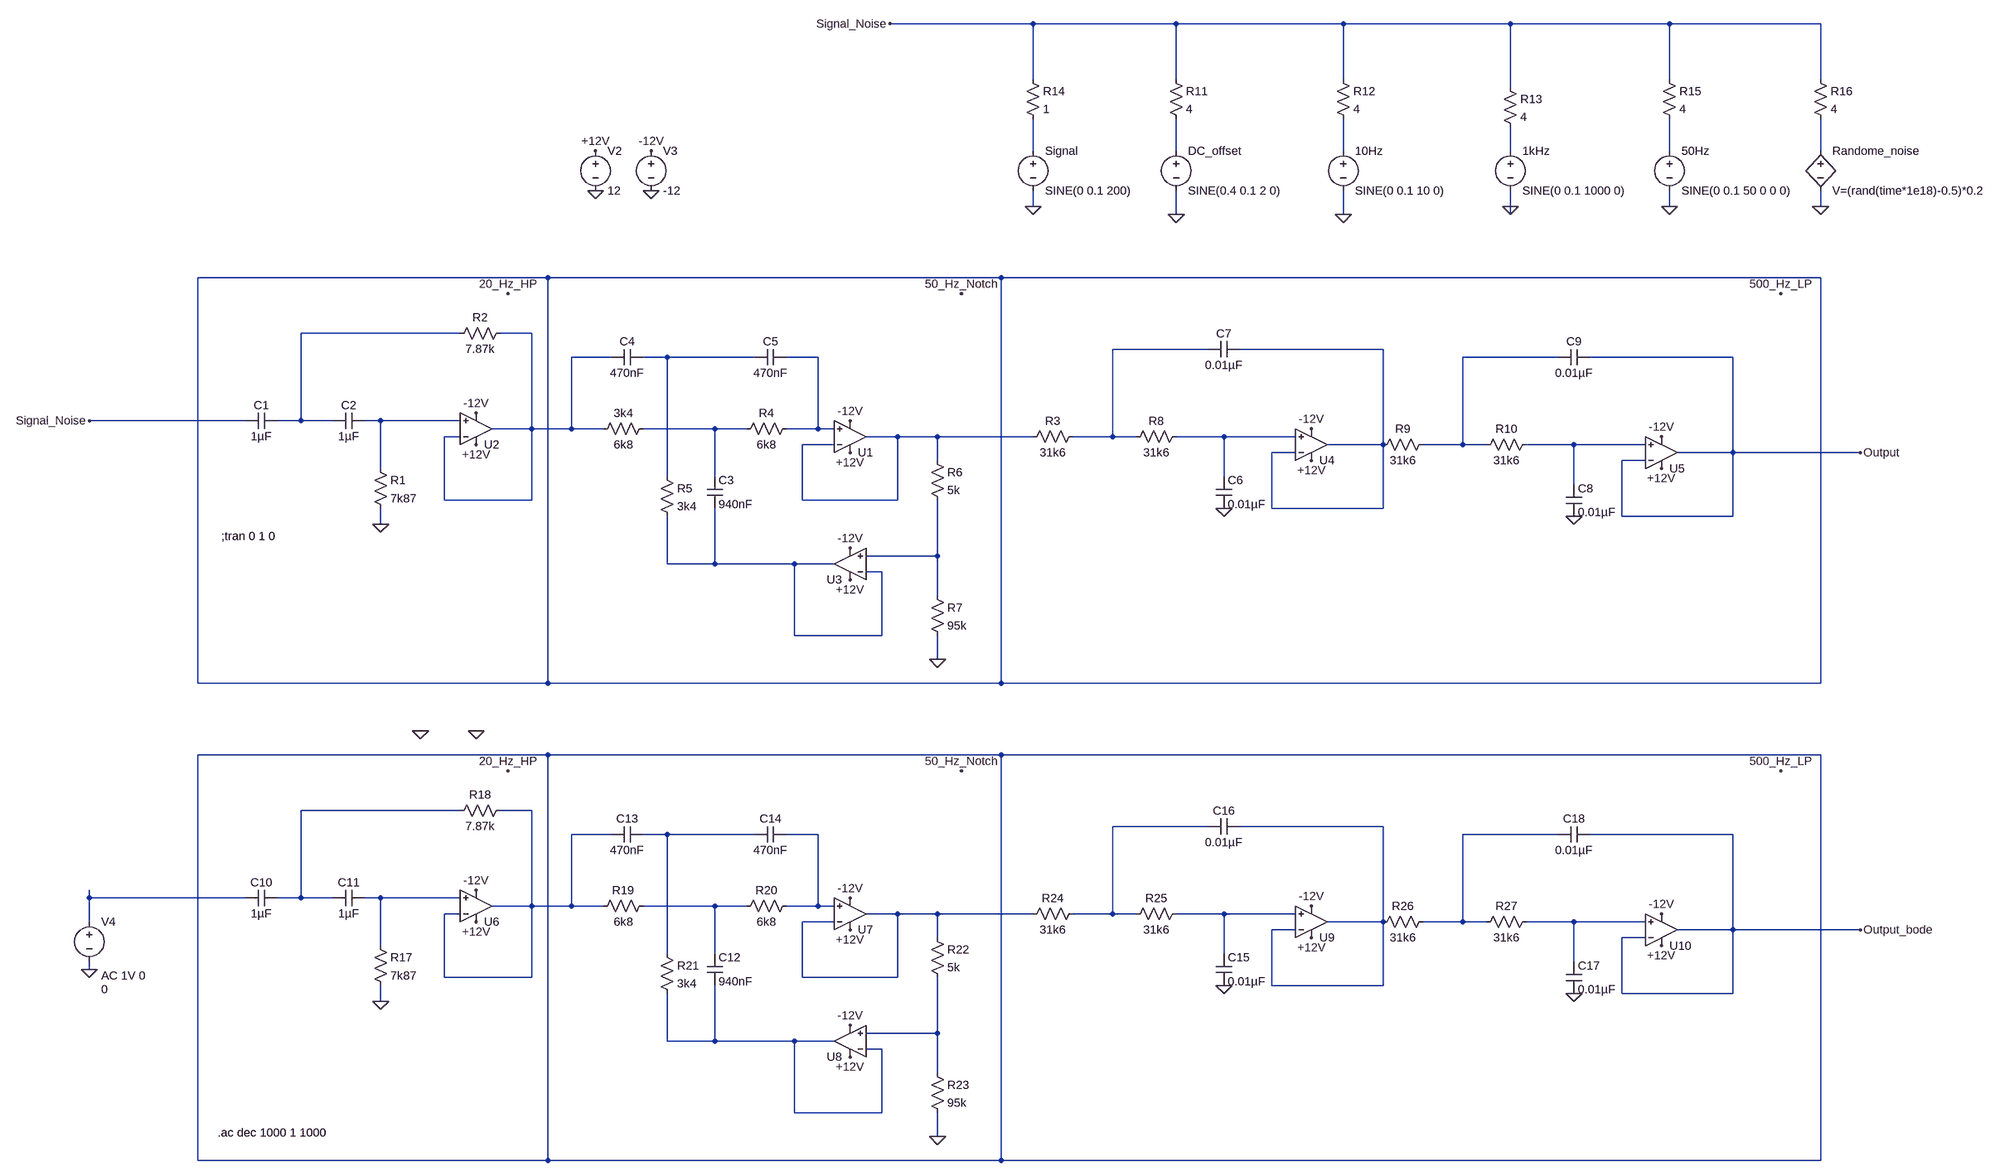
[diagram p0: schematic Analog_Filter_EMG.asc]
Analog_Filter_EMG.asc, the LTspice schematic file:
Version 4
SHEET 1 3124 1624
WIRE 1040 -912 752 -912
WIRE 1328 -912 1040 -912
WIRE 1664 -912 1328 -912
WIRE 2000 -912 1664 -912
WIRE 2320 -912 2000 -912
WIRE 2624 -912 2320 -912
WIRE 1040 -800 1040 -912
WIRE 1328 -800 1328 -912
WIRE 1664 -800 1664 -912
WIRE 2320 -800 2320 -912
WIRE 2624 -800 2624 -912
WIRE 2000 -784 2000 -912
WIRE 1040 -656 1040 -720
WIRE 1328 -656 1328 -720
WIRE 1664 -656 1664 -720
WIRE 2000 -656 2000 -704
WIRE 2320 -656 2320 -720
WIRE 2624 -656 2624 -720
WIRE 1040 -544 1040 -576
WIRE 2000 -544 2000 -576
WIRE 2320 -544 2320 -576
WIRE 2624 -544 2624 -576
WIRE 1328 -528 1328 -576
WIRE 1664 -528 1664 -576
WIRE 2000 -528 2000 -544
WIRE 64 -176 -640 -176
WIRE 976 -176 64 -176
WIRE 2624 -176 976 -176
WIRE -112 -64 -432 -64
WIRE 32 -64 -32 -64
WIRE 1392 -32 1200 -32
WIRE 1744 -32 1456 -32
WIRE 192 -16 112 -16
WIRE 304 -16 256 -16
WIRE 480 -16 304 -16
WIRE 608 -16 544 -16
WIRE 2096 -16 1904 -16
WIRE 2448 -16 2160 -16
WIRE -544 112 -928 112
WIRE -432 112 -432 -64
WIRE -432 112 -480 112
WIRE -368 112 -432 112
WIRE -272 112 -304 112
WIRE -112 112 -272 112
WIRE 32 128 32 -64
WIRE 32 128 -48 128
WIRE 112 128 112 -16
WIRE 112 128 32 128
WIRE 176 128 112 128
WIRE 400 128 256 128
WIRE 464 128 400 128
WIRE 608 128 608 -16
WIRE 608 128 544 128
WIRE 640 128 608 128
WIRE -112 144 -144 144
WIRE 768 144 704 144
WIRE 848 144 768 144
WIRE 1040 144 848 144
WIRE 1200 144 1200 -32
WIRE 1200 144 1120 144
WIRE 1248 144 1200 144
WIRE 1424 144 1328 144
WIRE 1568 144 1424 144
WIRE 640 160 576 160
WIRE 1744 160 1744 -32
WIRE 1744 160 1632 160
WIRE 1904 160 1904 -16
WIRE 1904 160 1824 160
WIRE 1952 160 1904 160
WIRE 2128 160 2032 160
WIRE 2272 160 2128 160
WIRE 1568 176 1520 176
WIRE 2448 176 2448 -16
WIRE 2448 176 2336 176
WIRE 2704 176 2448 176
WIRE 848 192 848 144
WIRE 2272 192 2224 192
WIRE -272 208 -272 112
WIRE 304 224 304 -16
WIRE 400 224 400 128
WIRE 1424 224 1424 144
WIRE 2128 240 2128 160
WIRE -144 272 -144 144
WIRE 32 272 32 128
WIRE 32 272 -144 272
WIRE 576 272 576 160
WIRE 768 272 768 144
WIRE 768 272 576 272
WIRE 1520 288 1520 176
WIRE 1744 288 1744 160
WIRE 1744 288 1520 288
WIRE 2224 304 2224 192
WIRE 2448 304 2448 176
WIRE 2448 304 2224 304
WIRE -272 320 -272 288
WIRE 848 384 848 272
WIRE 848 384 704 384
WIRE 304 400 304 304
WIRE 400 400 400 288
WIRE 400 400 304 400
WIRE 560 400 400 400
WIRE 640 400 560 400
WIRE 736 416 704 416
WIRE 848 464 848 384
WIRE 560 544 560 400
WIRE 736 544 736 416
WIRE 736 544 560 544
WIRE 848 592 848 544
WIRE -640 640 -640 -176
WIRE 64 640 64 -176
WIRE 64 640 -640 640
WIRE 976 640 976 -176
WIRE 976 640 64 640
WIRE 2624 640 2624 -176
WIRE 2624 640 976 640
WIRE 64 784 -640 784
WIRE 976 784 64 784
WIRE 2624 784 976 784
WIRE -112 896 -432 896
WIRE 32 896 -32 896
WIRE 1392 928 1200 928
WIRE 1744 928 1456 928
WIRE 192 944 112 944
WIRE 304 944 256 944
WIRE 480 944 304 944
WIRE 608 944 544 944
WIRE 2096 944 1904 944
WIRE 2448 944 2160 944
WIRE -928 1072 -928 1056
WIRE -544 1072 -928 1072
WIRE -432 1072 -432 896
WIRE -432 1072 -480 1072
WIRE -368 1072 -432 1072
WIRE -272 1072 -304 1072
WIRE -112 1072 -272 1072
WIRE 32 1088 32 896
WIRE 32 1088 -48 1088
WIRE 112 1088 112 944
WIRE 112 1088 32 1088
WIRE 176 1088 112 1088
WIRE 400 1088 256 1088
WIRE 464 1088 400 1088
WIRE 608 1088 608 944
WIRE 608 1088 544 1088
WIRE 640 1088 608 1088
WIRE -112 1104 -144 1104
WIRE 768 1104 704 1104
WIRE 848 1104 768 1104
WIRE 1040 1104 848 1104
WIRE 1200 1104 1200 928
WIRE 1200 1104 1120 1104
WIRE 1248 1104 1200 1104
WIRE 1424 1104 1328 1104
WIRE 1568 1104 1424 1104
WIRE -928 1120 -928 1072
WIRE 640 1120 576 1120
WIRE 1744 1120 1744 928
WIRE 1744 1120 1632 1120
WIRE 1904 1120 1904 944
WIRE 1904 1120 1824 1120
WIRE 1952 1120 1904 1120
WIRE 2128 1120 2032 1120
WIRE 2272 1120 2128 1120
WIRE 1568 1136 1520 1136
WIRE 2448 1136 2448 944
WIRE 2448 1136 2336 1136
WIRE 2704 1136 2448 1136
WIRE 848 1152 848 1104
WIRE 2272 1152 2224 1152
WIRE -272 1168 -272 1072
WIRE 304 1184 304 944
WIRE 400 1184 400 1088
WIRE 1424 1184 1424 1104
WIRE 2128 1200 2128 1120
WIRE -928 1216 -928 1200
WIRE -144 1232 -144 1104
WIRE 32 1232 32 1088
WIRE 32 1232 -144 1232
WIRE 576 1232 576 1120
WIRE 768 1232 768 1104
WIRE 768 1232 576 1232
WIRE 1520 1248 1520 1136
WIRE 1744 1248 1744 1120
WIRE 1744 1248 1520 1248
WIRE 2224 1264 2224 1152
WIRE 2448 1264 2448 1136
WIRE 2448 1264 2224 1264
WIRE -272 1280 -272 1248
WIRE 848 1344 848 1232
WIRE 848 1344 704 1344
WIRE 304 1360 304 1264
WIRE 400 1360 400 1248
WIRE 400 1360 304 1360
WIRE 560 1360 400 1360
WIRE 640 1360 560 1360
WIRE 736 1376 704 1376
WIRE 848 1424 848 1344
WIRE 560 1504 560 1360
WIRE 736 1504 736 1376
WIRE 736 1504 560 1504
WIRE 848 1552 848 1504
WIRE -640 1600 -640 784
WIRE 64 1600 64 784
WIRE 64 1600 -640 1600
WIRE 976 1600 976 784
WIRE 976 1600 64 1600
WIRE 2624 1600 2624 784
WIRE 2624 1600 976 1600
FLAG -272 320 0
FLAG 272 -576 0
FLAG 160 -576 0
FLAG 160 -656 +12V
FLAG 272 -656 -12V
FLAG -80 96 -12V
FLAG -80 160 +12V
FLAG 848 592 0
FLAG 672 112 -12V
FLAG 672 368 -12V
FLAG 672 176 +12V
FLAG 672 432 +12V
FLAG 1424 288 0
FLAG 1600 128 -12V
FLAG 1600 192 +12V
FLAG 2128 304 0
FLAG 2304 144 -12V
FLAG 2304 208 +12V
FLAG 1328 -528 0
FLAG 1664 -528 0
FLAG 2000 -544 0
FLAG 1040 -544 0
FLAG 752 -912 Signal_Noise
FLAG -928 112 Signal_Noise
FLAG 2320 -544 0
FLAG 2624 -544 0
FLAG -16 -144 20_Hz_HP
FLAG 896 -144 50_Hz_Notch
FLAG 2544 -144 500_Hz_LP
FLAG 2704 176 Output
FLAG -272 1280 0
FLAG -80 736 0
FLAG -192 736 0
FLAG -80 1056 -12V
FLAG -80 1120 +12V
FLAG 848 1552 0
FLAG 672 1072 -12V
FLAG 672 1328 -12V
FLAG 672 1136 +12V
FLAG 672 1392 +12V
FLAG 1424 1248 0
FLAG 1600 1088 -12V
FLAG 1600 1152 +12V
FLAG 2128 1264 0
FLAG 2304 1104 -12V
FLAG 2304 1168 +12V
FLAG -16 816 20_Hz_HP
FLAG 896 816 50_Hz_Notch
FLAG 2544 816 500_Hz_LP
FLAG 2704 1136 Output_bode
FLAG -928 1216 0
SYMBOL cap -480 96 R90
WINDOW 0 0 32 VBottom 2
WINDOW 3 32 32 VTop 2
SYMATTR InstName C1
SYMATTR Value 1µF
SYMBOL cap -304 96 R90
WINDOW 0 0 32 VBottom 2
WINDOW 3 32 32 VTop 2
SYMATTR InstName C2
SYMATTR Value 1µF
SYMBOL res -288 192 R0
SYMATTR InstName R1
SYMATTR Value 7k87
SYMBOL res -16 -80 R90
WINDOW 0 0 56 VBottom 2
WINDOW 3 32 56 VTop 2
SYMATTR InstName R2
SYMATTR Value 7.87k
SYMBOL voltage 1664 -672 R0
WINDOW 123 0 0 Left 0
WINDOW 39 0 0 Left 0
SYMATTR InstName 10Hz
SYMATTR Value SINE(0 0.1 10 0)
SYMBOL Opamps\\UniversalOpamp2 -80 128 M180
SYMATTR InstName U2
SYMBOL voltage 160 -672 R0
WINDOW 123 0 0 Left 0
WINDOW 39 0 0 Left 0
SYMATTR InstName V2
SYMATTR Value 12
SYMBOL voltage 272 -672 R0
WINDOW 123 0 0 Left 0
WINDOW 39 0 0 Left 0
SYMATTR InstName V3
SYMATTR Value -12
SYMBOL res 272 112 R90
WINDOW 0 0 56 VBottom 2
WINDOW 3 32 56 VTop 2
SYMATTR InstName 3k4
SYMATTR Value 6k8
SYMBOL res 560 112 R90
WINDOW 0 0 56 VBottom 2
WINDOW 3 32 56 VTop 2
SYMATTR InstName R4
SYMATTR Value 6k8
SYMBOL cap 384 224 R0
SYMATTR InstName C3
SYMATTR Value 940nF
SYMBOL res 288 208 R0
SYMATTR InstName R5
SYMATTR Value 3k4
SYMBOL cap 256 -32 R90
WINDOW 0 0 32 VBottom 2
WINDOW 3 32 32 VTop 2
SYMATTR InstName C4
SYMATTR Value 470nF
SYMBOL cap 544 -32 R90
WINDOW 0 0 32 VBottom 2
WINDOW 3 32 32 VTop 2
SYMATTR InstName C5
SYMATTR Value 470nF
SYMBOL res 832 176 R0
SYMATTR InstName R6
SYMATTR Value 5k
SYMBOL res 832 448 R0
SYMATTR InstName R7
SYMATTR Value 95k
SYMBOL Opamps\\UniversalOpamp2 672 144 M180
SYMATTR InstName U1
SYMBOL Opamps\\UniversalOpamp2 672 400 R180
SYMATTR InstName U3
SYMBOL res 1136 128 R90
WINDOW 0 0 56 VBottom 2
WINDOW 3 32 56 VTop 2
SYMATTR InstName R3
SYMATTR Value 31k6
SYMBOL res 1344 128 R90
WINDOW 0 0 56 VBottom 2
WINDOW 3 32 56 VTop 2
SYMATTR InstName R8
SYMATTR Value 31k6
SYMBOL cap 1408 224 R0
SYMATTR InstName C6
SYMATTR Value 0.01µF
SYMBOL cap 1456 -48 R90
WINDOW 0 0 32 VBottom 2
WINDOW 3 32 32 VTop 2
SYMATTR InstName C7
SYMATTR Value 0.01µF
SYMBOL Opamps\\UniversalOpamp2 1600 160 M180
SYMATTR InstName U4
SYMBOL res 1840 144 R90
WINDOW 0 0 56 VBottom 2
WINDOW 3 32 56 VTop 2
SYMATTR InstName R9
SYMATTR Value 31k6
SYMBOL res 2048 144 R90
WINDOW 0 0 56 VBottom 2
WINDOW 3 32 56 VTop 2
SYMATTR InstName R10
SYMATTR Value 31k6
SYMBOL cap 2112 240 R0
SYMATTR InstName C8
SYMATTR Value 0.01µF
SYMBOL cap 2160 -32 R90
WINDOW 0 0 32 VBottom 2
WINDOW 3 32 32 VTop 2
SYMATTR InstName C9
SYMATTR Value 0.01µF
SYMBOL Opamps\\UniversalOpamp2 2304 176 M180
SYMATTR InstName U5
SYMBOL voltage 2000 -672 R0
WINDOW 123 0 0 Left 0
WINDOW 39 0 0 Left 0
SYMATTR InstName 1kHz
SYMATTR Value SINE(0 0.1 1000 0)
SYMBOL voltage 1328 -672 R0
WINDOW 123 0 0 Left 0
WINDOW 39 0 0 Left 0
SYMATTR InstName DC_offset
SYMATTR Value SINE(0.4 0.1 2 0)
SYMBOL res 1312 -816 R0
SYMATTR InstName R11
SYMATTR Value 4
SYMBOL res 1648 -816 R0
SYMATTR InstName R12
SYMATTR Value 4
SYMBOL res 1984 -800 R0
SYMATTR InstName R13
SYMATTR Value 4
SYMBOL voltage 1040 -672 R0
WINDOW 123 0 0 Left 0
WINDOW 39 0 0 Left 0
SYMATTR InstName Signal
SYMATTR Value SINE(0 0.1 200)
SYMBOL res 1024 -816 R0
SYMATTR InstName R14
SYMATTR Value 1
SYMBOL voltage 2320 -672 R0
WINDOW 123 0 0 Left 0
WINDOW 39 0 0 Left 0
SYMATTR InstName 50Hz
SYMATTR Value SINE(0 0.1 50 0 0 0)
SYMBOL res 2304 -816 R0
SYMATTR InstName R15
SYMATTR Value 4
SYMBOL bv 2624 -672 R0
SYMATTR InstName Randome_noise
SYMATTR Value V=(rand(time*1e18)-0.5)*0.2
SYMBOL res 2608 -816 R0
SYMATTR InstName R16
SYMATTR Value 4
SYMBOL cap -480 1056 R90
WINDOW 0 0 32 VBottom 2
WINDOW 3 32 32 VTop 2
SYMATTR InstName C10
SYMATTR Value 1µF
SYMBOL cap -304 1056 R90
WINDOW 0 0 32 VBottom 2
WINDOW 3 32 32 VTop 2
SYMATTR InstName C11
SYMATTR Value 1µF
SYMBOL res -288 1152 R0
SYMATTR InstName R17
SYMATTR Value 7k87
SYMBOL res -16 880 R90
WINDOW 0 0 56 VBottom 2
WINDOW 3 32 56 VTop 2
SYMATTR InstName R18
SYMATTR Value 7.87k
SYMBOL Opamps\\UniversalOpamp2 -80 1088 M180
SYMATTR InstName U6
SYMBOL res 272 1072 R90
WINDOW 0 0 56 VBottom 2
WINDOW 3 32 56 VTop 2
SYMATTR InstName R19
SYMATTR Value 6k8
SYMBOL res 560 1072 R90
WINDOW 0 0 56 VBottom 2
WINDOW 3 32 56 VTop 2
SYMATTR InstName R20
SYMATTR Value 6k8
SYMBOL cap 384 1184 R0
SYMATTR InstName C12
SYMATTR Value 940nF
SYMBOL res 288 1168 R0
SYMATTR InstName R21
SYMATTR Value 3k4
SYMBOL cap 256 928 R90
WINDOW 0 0 32 VBottom 2
WINDOW 3 32 32 VTop 2
SYMATTR InstName C13
SYMATTR Value 470nF
SYMBOL cap 544 928 R90
WINDOW 0 0 32 VBottom 2
WINDOW 3 32 32 VTop 2
SYMATTR InstName C14
SYMATTR Value 470nF
SYMBOL res 832 1136 R0
SYMATTR InstName R22
SYMATTR Value 5k
SYMBOL res 832 1408 R0
SYMATTR InstName R23
SYMATTR Value 95k
SYMBOL Opamps\\UniversalOpamp2 672 1104 M180
SYMATTR InstName U7
SYMBOL Opamps\\UniversalOpamp2 672 1360 R180
SYMATTR InstName U8
SYMBOL res 1136 1088 R90
WINDOW 0 0 56 VBottom 2
WINDOW 3 32 56 VTop 2
SYMATTR InstName R24
SYMATTR Value 31k6
SYMBOL res 1344 1088 R90
WINDOW 0 0 56 VBottom 2
WINDOW 3 32 56 VTop 2
SYMATTR InstName R25
SYMATTR Value 31k6
SYMBOL cap 1408 1184 R0
SYMATTR InstName C15
SYMATTR Value 0.01µF
SYMBOL cap 1456 912 R90
WINDOW 0 0 32 VBottom 2
WINDOW 3 32 32 VTop 2
SYMATTR InstName C16
SYMATTR Value 0.01µF
SYMBOL Opamps\\UniversalOpamp2 1600 1120 M180
SYMATTR InstName U9
SYMBOL res 1840 1104 R90
WINDOW 0 0 56 VBottom 2
WINDOW 3 32 56 VTop 2
SYMATTR InstName R26
SYMATTR Value 31k6
SYMBOL res 2048 1104 R90
WINDOW 0 0 56 VBottom 2
WINDOW 3 32 56 VTop 2
SYMATTR InstName R27
SYMATTR Value 31k6
SYMBOL cap 2112 1200 R0
SYMATTR InstName C17
SYMATTR Value 0.01µF
SYMBOL cap 2160 928 R90
WINDOW 0 0 32 VBottom 2
WINDOW 3 32 32 VTop 2
SYMATTR InstName C18
SYMATTR Value 0.01µF
SYMBOL Opamps\\UniversalOpamp2 2304 1136 M180
SYMATTR InstName U10
SYMBOL voltage -928 1104 R0
WINDOW 3 24 152 Left 2
WINDOW 123 24 124 Left 2
WINDOW 39 0 0 Left 0
SYMATTR Value 0
SYMATTR Value2 AC 1V 0
SYMATTR InstName V4
TEXT -592 344 Left 2 !;tran 0 1 0
TEXT -600 1544 Left 2 !.ac dec 1000 1 1000

The netlist it stands for:
* Analog_Filter_EMG.asc
C1 N008 Signal_Noise 1µF
C2 N015 N008 1µF
R1 N015 0 7k87
R2 N009 N008 7.87k
V§10Hz N003 0 SINE(0 0.1 10 0)
XU2 N015 N009 +12V -12V N009 level.2 Avol=1Meg GBW=10Meg Slew=10Meg ilimit=25m rail=0 Vos=0 phimargin=45 en=0 enk=0 in=0 ink=0 Rin=500Meg  ; pins IN+ IN- V+ V- OUT
V2 +12V 0 12
V3 -12V 0 -12
R§3k4 N016 N009 6k8
R4 N013 N016 6k8
C3 N016 N021 940nF
R5 N012 N021 3k4
C4 N012 N009 470nF
C5 N013 N012 470nF
R6 N017 N020 5k
R7 N020 0 95k
XU1 N013 N017 +12V -12V N017 level.2 Avol=1Meg GBW=10Meg Slew=10Meg ilimit=25m rail=0 Vos=0 phimargin=45 en=0 enk=0 in=0 ink=0 Rin=500Meg  ; pins IN+ IN- V+ V- OUT
XU3 N020 N021 +12V -12V N021 level.2 Avol=1Meg GBW=10Meg Slew=10Meg ilimit=25m rail=0 Vos=0 phimargin=45 en=0 enk=0 in=0 ink=0 Rin=500Meg  ; pins IN+ IN- V+ V- OUT
R3 N010 N017 31k6
R8 N018 N010 31k6
C6 N018 0 0.01µF
C7 N011 N010 0.01µF
XU4 N018 N011 +12V -12V N011 level.2 Avol=1Meg GBW=10Meg Slew=10Meg ilimit=25m rail=0 Vos=0 phimargin=45 en=0 enk=0 in=0 ink=0 Rin=500Meg  ; pins IN+ IN- V+ V- OUT
R9 N014 N011 31k6
R10 N019 N014 31k6
C8 N019 0 0.01µF
C9 Output N014 0.01µF
XU5 N019 Output +12V -12V Output level.2 Avol=1Meg GBW=10Meg Slew=10Meg ilimit=25m rail=0 Vos=0 phimargin=45 en=0 enk=0 in=0 ink=0 Rin=500Meg  ; pins IN+ IN- V+ V- OUT
V§1kHz N004 0 SINE(0 0.1 1000 0)
V§DC_offset N002 0 SINE(0.4 0.1 2 0)
R11 Signal_Noise N002 4
R12 Signal_Noise N003 4
R13 Signal_Noise N004 4
V§Signal N001 0 SINE(0 0.1 200)
R14 Signal_Noise N001 1
V§50Hz N005 0 SINE(0 0.1 50 0 0 0)
R15 Signal_Noise N005 4
B§Randome_noise N006 0 V=(rand(time*1e18)-0.5)*0.2
R16 Signal_Noise N006 4
C10 N023 N030 1µF
C11 N031 N023 1µF
R17 N031 0 7k87
R18 N024 N023 7.87k
XU6 N031 N024 +12V -12V N024 level.2 Avol=1Meg GBW=10Meg Slew=10Meg ilimit=25m rail=0 Vos=0 phimargin=45 en=0 enk=0 in=0 ink=0 Rin=500Meg  ; pins IN+ IN- V+ V- OUT
R19 N032 N024 6k8
R20 N028 N032 6k8
C12 N032 N037 940nF
R21 N027 N037 3k4
C13 N027 N024 470nF
C14 N028 N027 470nF
R22 N033 N036 5k
R23 N036 0 95k
XU7 N028 N033 +12V -12V N033 level.2 Avol=1Meg GBW=10Meg Slew=10Meg ilimit=25m rail=0 Vos=0 phimargin=45 en=0 enk=0 in=0 ink=0 Rin=500Meg  ; pins IN+ IN- V+ V- OUT
XU8 N036 N037 +12V -12V N037 level.2 Avol=1Meg GBW=10Meg Slew=10Meg ilimit=25m rail=0 Vos=0 phimargin=45 en=0 enk=0 in=0 ink=0 Rin=500Meg  ; pins IN+ IN- V+ V- OUT
R24 N025 N033 31k6
R25 N034 N025 31k6
C15 N034 0 0.01µF
C16 N026 N025 0.01µF
XU9 N034 N026 +12V -12V N026 level.2 Avol=1Meg GBW=10Meg Slew=10Meg ilimit=25m rail=0 Vos=0 phimargin=45 en=0 enk=0 in=0 ink=0 Rin=500Meg  ; pins IN+ IN- V+ V- OUT
R26 N029 N026 31k6
R27 N035 N029 31k6
C17 N035 0 0.01µF
C18 Output_bode N029 0.01µF
XU10 N035 Output_bode +12V -12V Output_bode level.2 Avol=1Meg GBW=10Meg Slew=10Meg ilimit=25m rail=0 Vos=0 phimargin=45 en=0 enk=0 in=0 ink=0 Rin=500Meg  ; pins IN+ IN- V+ V- OUT
V4 N030 0 0 AC 1V 0
;tran 0 1 0
.ac dec 1000 1 1000
.lib UniversalOpamps2.sub
.backanno
.end